# EAGLE design untitled (EAGLE 5.08)
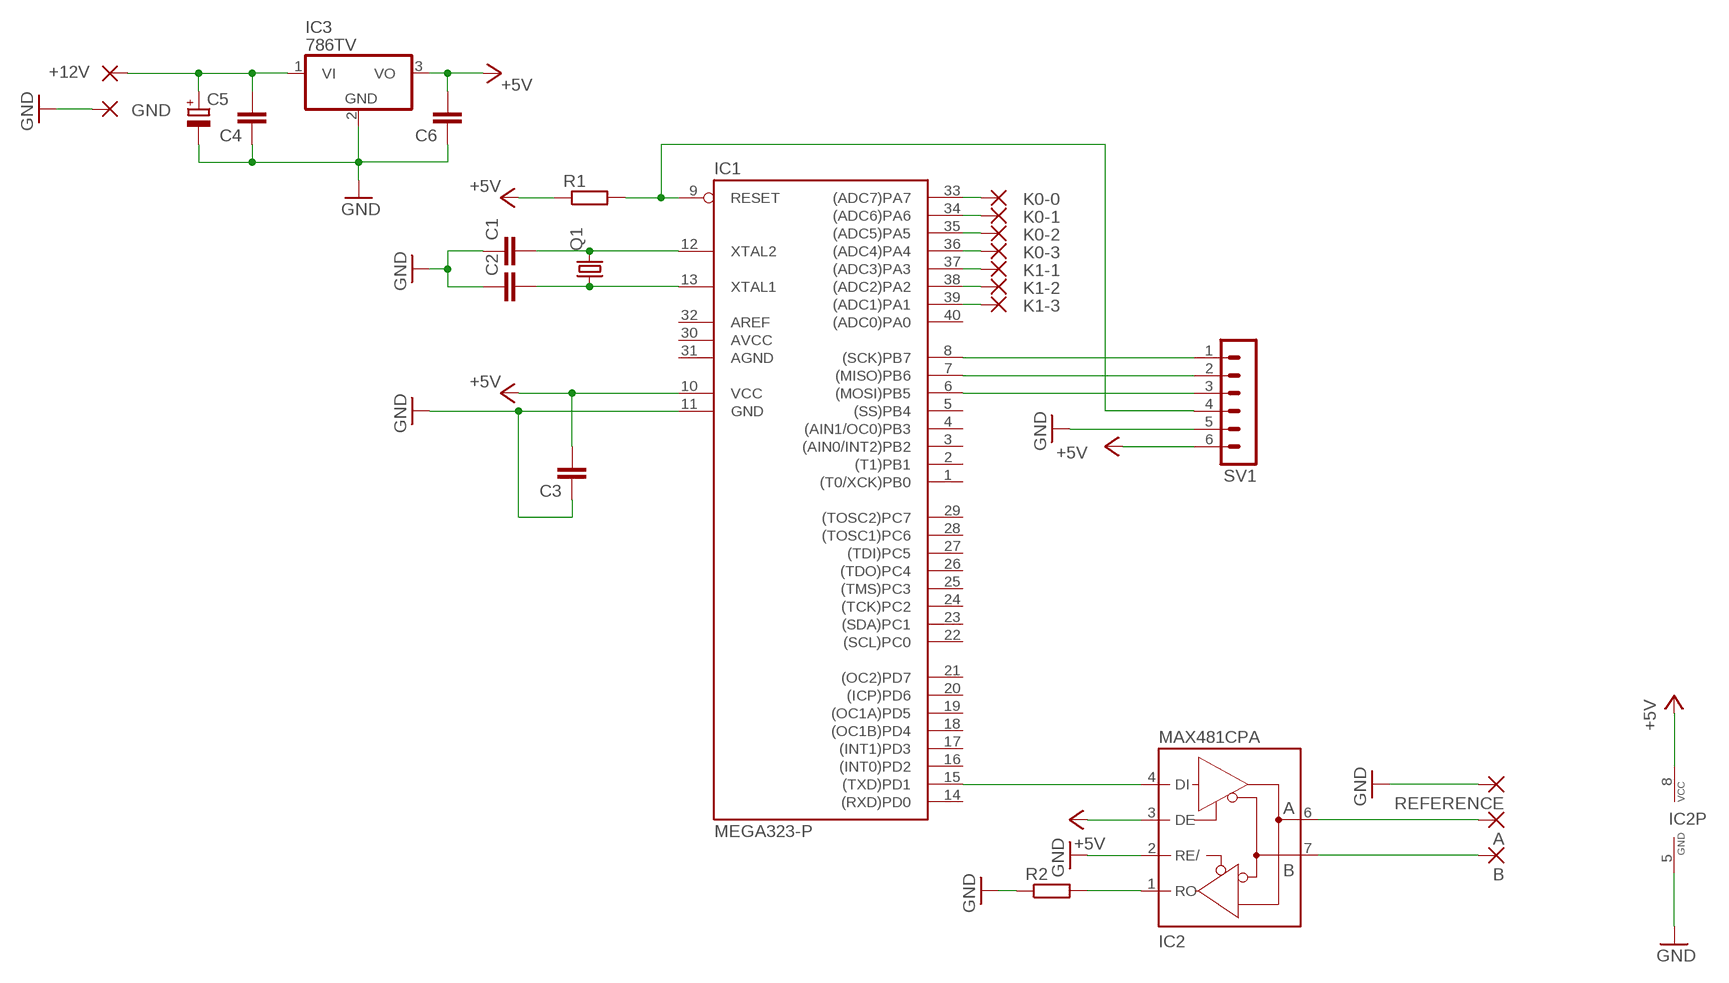
[diagram p0: schematic, sheet 1]

## Parts
+12V  2,54/0,8  [2,54/0,8]
A  2,54/0,8  [2,54/0,8]
B  2,54/0,8  [2,54/0,8]
C1  C-EU025-025X050  [C025-025X050]
C2  C-EU025-025X050  [C025-025X050]
C3  C-EU025-025X050  [C025-025X050]
C4  C-EU025-025X050  [C025-025X050]
C5  CPOL-EUE2.5-5  [E2,5-5]
C6  C-EU025-025X050  [C025-025X050]
GND  2,54/0,8  [2,54/0,8]
IC1  MEGA323-P  [DIL40]
IC2  MAX481CPA  [DIL08]
IC3  786TV  [TO220V]
K0-0  2,54/0,8  [2,54/0,8]
K0-1  2,54/0,8  [2,54/0,8]
K0-2  2,54/0,8  [2,54/0,8]
K0-3  2,54/0,8  [2,54/0,8]
K1-1  2,54/0,8  [2,54/0,8]
K1-2  2,54/0,8  [2,54/0,8]
K1-3  2,54/0,8  [2,54/0,8]
Q1  CRYSTALHC49S  [HC49/S]
R1  R-EU_0207/10  [0207/10]
R2  R-EU_0207/7  [0207/7]
REFERENCE  2,54/0,8  [2,54/0,8]
SV1  MA06-1  [MA06-1]

## Nets
+5V: C3.2 C6.2 IC1.10(VCC) IC2.3(DE) IC2.8(VCC) IC3.3(VO) R1.1 SV1.6
GND: C1.1 C2.1 C3.1 C4.1 C5.- C6.1 GND.1(P) IC1.11(GND) IC2.2(RE/) IC2.5(GND) IC3.2(GND) R2.1 REFERENCE.1(P) SV1.5
N$1: B.1(P) IC2.7(B)
N$2: A.1(P) IC2.6(A)
N$3: IC1.9(RESET) R1.2 SV1.4
N$4: IC1.15((TXD)PD1) IC2.4(DI)
N$5: C2.2 IC1.13(XTAL1) Q1.1
N$6: C1.2 IC1.12(XTAL2) Q1.2
N$7: IC1.33((ADC7)PA7) K0-0.1(P)
N$8: IC2.1(RO) R2.2
N$9: IC1.34((ADC6)PA6) K0-1.1(P)
N$10: IC1.35((ADC5)PA5) K0-2.1(P)
N$11: IC1.36((ADC4)PA4) K0-3.1(P)
N$12: IC1.37((ADC3)PA3) K1-1.1(P)
N$13: IC1.38((ADC2)PA2) K1-2.1(P)
N$14: IC1.39((ADC1)PA1) K1-3.1(P)
N$16: IC1.8((SCK)PB7) SV1.1
N$17: IC1.7((MISO)PB6) SV1.2
N$18: IC1.6((MOSI)PB5) SV1.3
N$20: +12V.1(P) C4.2 C5.+ IC3.1(VI)
Unconnected: IC1.1((T0/XCK)PB0) IC1.2((T1)PB1) IC1.3((AIN0/INT2)PB2) IC1.4((AIN1/OC0)PB3) IC1.5((SS)PB4) IC1.14((RXD)PD0) IC1.16((INT0)PD2) IC1.17((INT1)PD3) IC1.18((OC1B)PD4) IC1.19((OC1A)PD5) IC1.20((ICP)PD6) IC1.21((OC2)PD7) IC1.22((SCL)PC0) IC1.23((SDA)PC1) IC1.24((TCK)PC2) IC1.25((TMS)PC3) IC1.26((TDO)PC4) IC1.27((TDI)PC5) IC1.28((TOSC1)PC6) IC1.29((TOSC2)PC7) IC1.32(AREF) IC1.40((ADC0)PA0)

## Power pins joined to a net without a drawn wire
AGND: IC1.31(AGND)
AVCC: IC1.30(AVCC)

## Library data of the parts
+12V A B GND K0-0 K0-1-K0-3 K1-1-K1-3 REFERENCE = wirepad:2,54/0,8: THROUGH-HOLE PAD
C1-C4 C6 = rcl:C-EU: CAPACITOR, European symbol
C5 = rcl:CPOL-EU: POLARIZED CAPACITOR, European symbol
IC1 = atmel:MEGA323-P: MICROCONTROLLER 32 Kbytes FLASH 2 Kbytes SRAM 1 Kbytes EEPROM USART 8-channel 10 bit ADC Source: avr.lbr
IC2 = maxim:MAX481CPA: RS485 TRANSEIVER
IC3 = linear:78*: Positive VOLTAGE REGULATOR Source: http://cache.national.com/ds/LM/LM78L05.pdf http://www.fairchildsemi.com/ds/LM/LM7805.pdf
Q1 = crystal:CRYSTAL: CRYSTAL
R1 R2 = rcl:R-EU_: RESISTOR, European symbol
SV1 = con-lstb:MA06-1: PIN HEADER

## Board
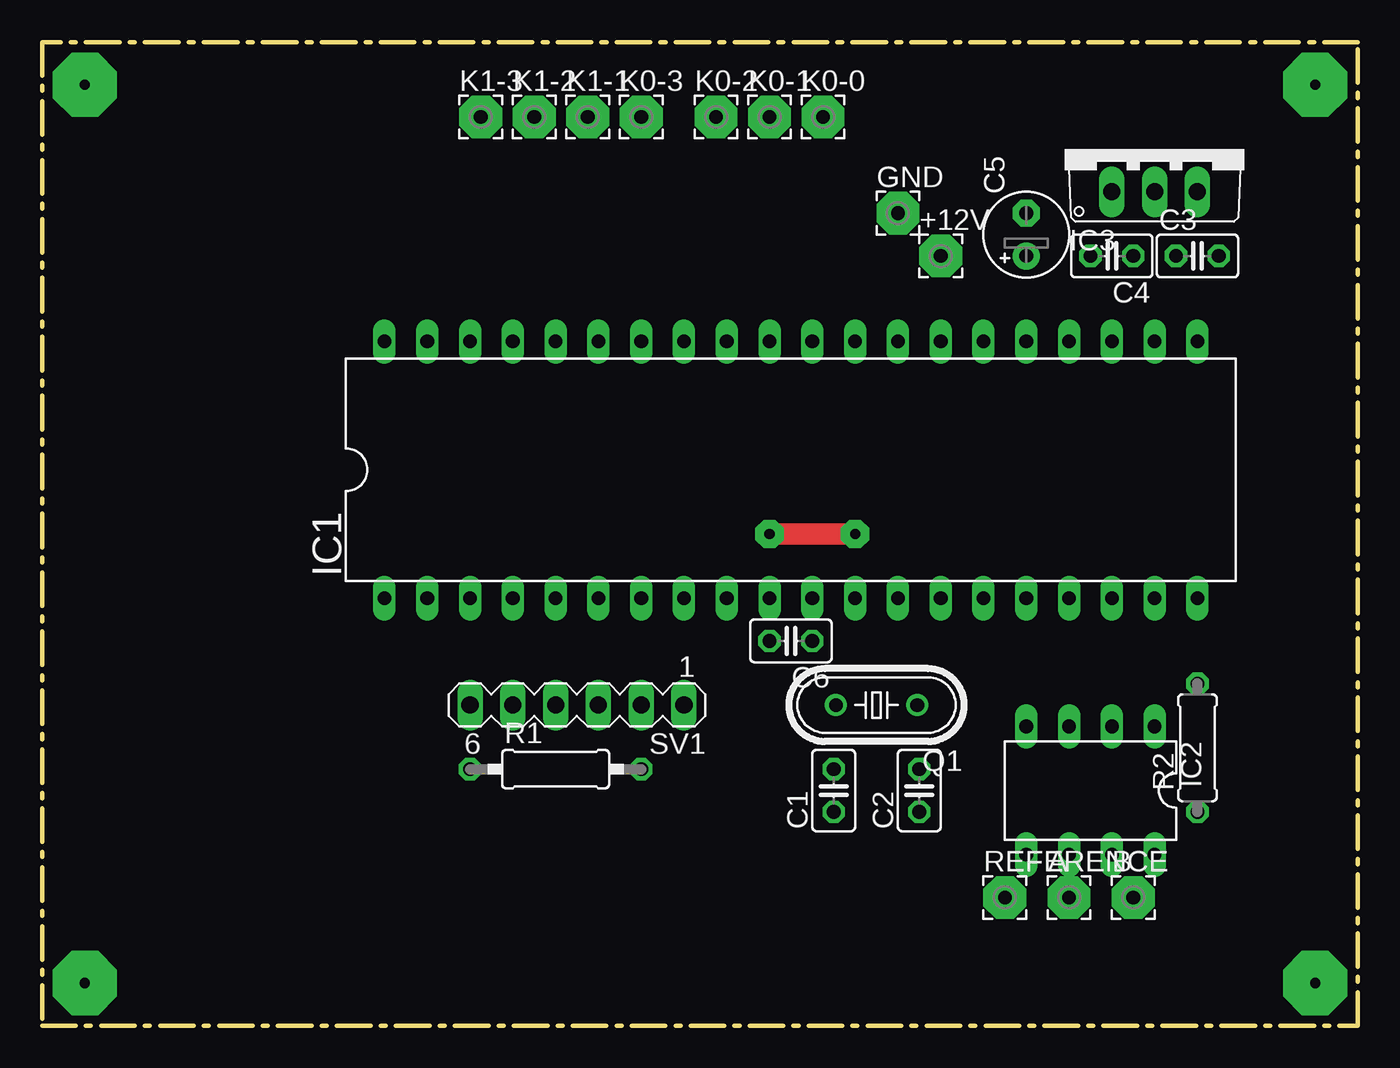
[diagram p1: board, top side]
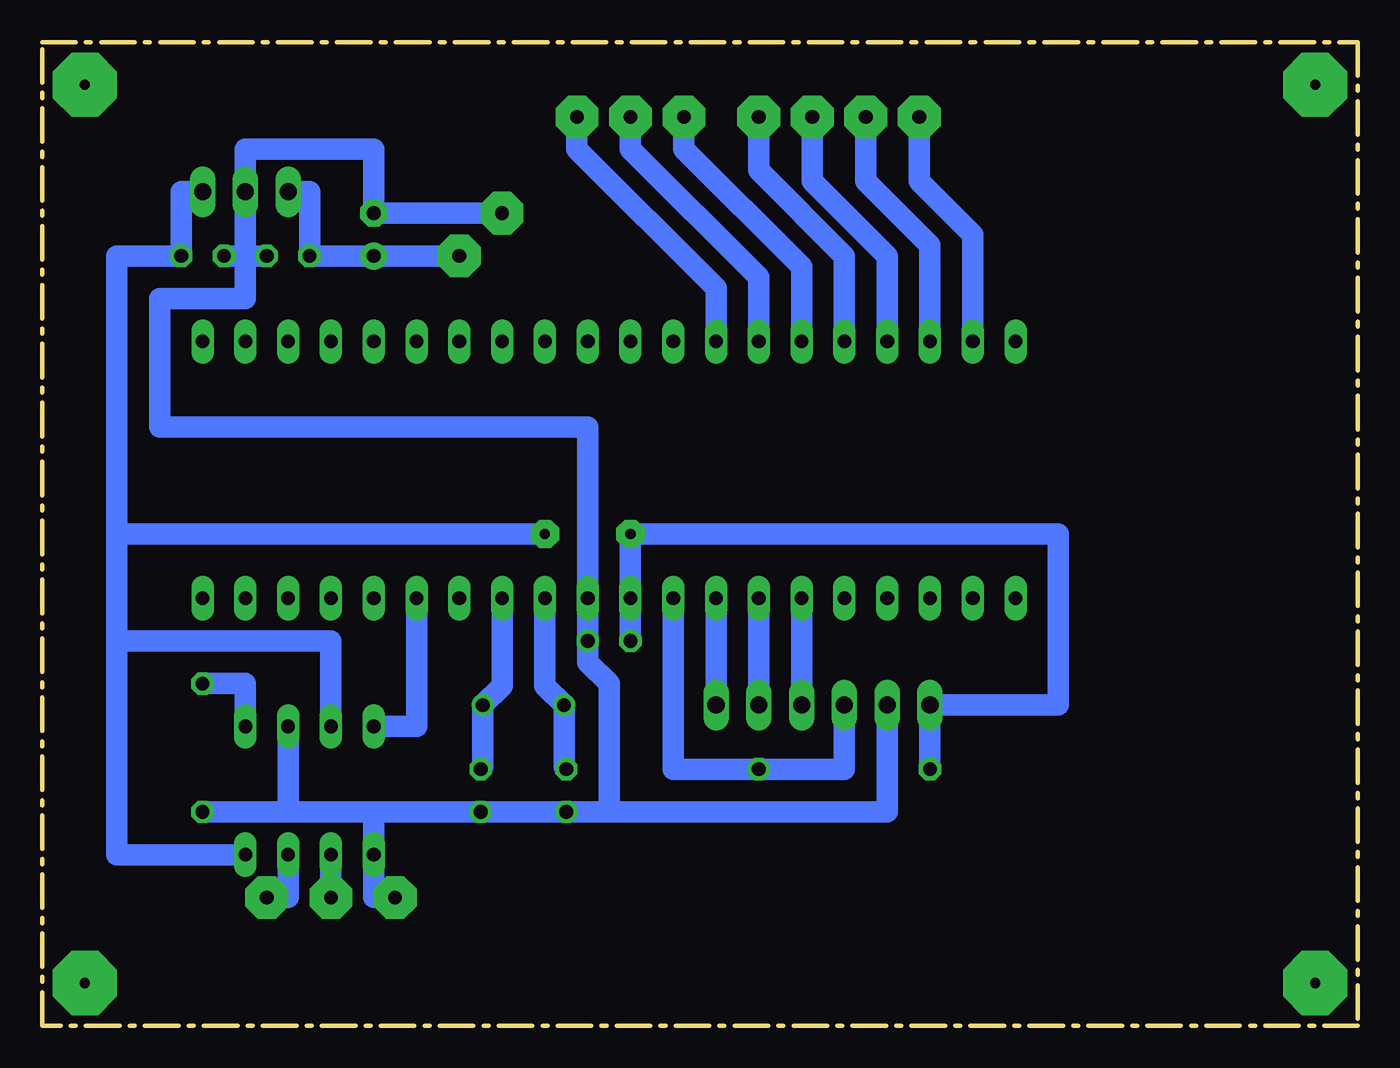
[diagram p2: board, bottom side, seen from below]

Size 78.1 x 58.42 mm. Coordinates in mm from the lower left corner, seen from the top.
Outline: 0,0 78.1,0 78.1,58.42 0,58.42 0,0
Copper layers (1*16): Top 0.035mm / dielectric 1.5mm / Bottom 0.035mm
Design rules "default": minimum track width 10mil, minimum drill 24mil, track to track 8mil, track to pad 8mil, pad to pad 8mil, via to via 8mil, smd to smd 8mil, copper to edge 40mil, drill to drill 8mil, minimum pad ring 10mil, minimum via ring 8mil, stop-mask expansion 4mil, vias tented up to drill 0mil, thermal gap 10mil

### Footprints (pad centres in the part's own frame; a part is rotated, then mirrored left to right if it is on the bottom)
2,54/0,8 = drill 0.813 pad 2.54 octagon: 1 0,0
C025-025X050 = drill 0.813 octagon: 1 -1.27,0; 2 1.27,0
E2,5-5 = drill 0.813 pad 1.6 round: + -1.27,0 | drill 0.813 pad 1.6 octagon: - 1.27,0
DIL40 = drill 0.813 long: 1 -24.13,-7.62; 2 -21.59,-7.62; 3 -19.05,-7.62; 4 -16.51,-7.62; 5 -13.97,-7.62; 6 -11.43,-7.62; 7 -8.89,-7.62; 8 -6.35,-7.62; 9 -3.81,-7.62; 10 -1.27,-7.62; 11 1.27,-7.62; 12 3.81,-7.62; 13 6.35,-7.62; 14 8.89,-7.62; 15 11.43,-7.62; 16 13.97,-7.62; 17 16.51,-7.62; 18 19.05,-7.62; 19 21.59,-7.62; 20 24.13,-7.62; 21 24.13,7.62; 22 21.59,7.62; 23 19.05,7.62; 24 16.51,7.62; 25 13.97,7.62; 26 11.43,7.62; 27 8.89,7.62; 28 6.35,7.62; 29 3.81,7.62; 30 1.27,7.62; 31 -1.27,7.62; 32 -3.81,7.62; 33 -6.35,7.62; 34 -8.89,7.62; 35 -11.43,7.62; 36 -13.97,7.62; 37 -16.51,7.62; 38 -19.05,7.62; 39 -21.59,7.62; 40 -24.13,7.62
DIL08 = drill 0.813 long: 1 -3.81,-3.81; 2 -1.27,-3.81; 3 1.27,-3.81; 4 3.81,-3.81; 5 3.81,3.81; 6 1.27,3.81; 7 -1.27,3.81; 8 -3.81,3.81
TO220V = drill 1.016 long: 1 -2.54,-2.54; 2 0,-2.54; 3 2.54,-2.54
HC49/S = drill 0.813 round: 1 -2.413,0; 2 2.413,0
0207/10 = drill 0.813 octagon: 1 -5.08,0; 2 5.08,0
0207/7 = drill 0.813 octagon: 1 -3.81,0; 2 3.81,0
MA06-1 = drill 1.016 long: 1 -6.35,0; 2 -3.81,0; 3 -1.27,0; 4 1.27,0; 5 3.81,0; 6 6.35,0

### Placement (x,y rotation side)
+12V  53.34,45.72 0 top
A  60.96,7.62 0 top
B  64.77,7.62 0 top
C1  46.99,13.97 90 top
C2  52.07,13.97 90 top
C3  68.58,45.72 0 top
C4  63.5,45.72 180 top
C5  58.42,46.99 90 top
C6  44.45,22.86 180 top
GND  50.8,48.26 0 top
IC1  44.45,33.02 0 top
IC2  62.23,13.97 180 top
IC3  66.04,52.07 0 top
K0-0  46.35,53.97 0 top
K0-1  43.18,53.97 0 top
K0-2  40,53.97 0 top
K0-3  35.56,53.97 0 top
K1-1  32.38,53.97 0 top
K1-2  29.21,53.97 0 top
K1-3  26.03,53.97 0 top
Q1  49.53,19.05 180 top
R1  30.48,15.24 0 top
R2  68.58,16.51 90 top
REFERENCE  57.15,7.62 0 top
SV1  31.75,19.05 180 top

### Tracks (layer width: path | path; a pad name or v marks a point on that pad's centre or on a via)
+5V  (via drill 0.6 pad 1.68)
  Top 1.27: v48.26,29.21 v43.18,29.21
  Bottom 1.27: R1.1 SV1.6 17.78,19.05 17.78,29.21 v43.18,29.21 IC1.10 C6.2 | IC2.3 60.96,22.86 73.66,22.86 | IC2.8 73.66,10.16 73.66,22.86 | IC3.3 69.85,49.53 C3.2 73.66,45.72 73.66,29.21 | 73.66,29.21 73.66,22.86 | 73.66,29.21 v48.26,29.21
GND
  Bottom 1.27: 44.45,12.7 44.45,20.32 45.72,21.59 C6.1 IC1.11 45.72,35.56 71.12,35.56 71.12,43.18 66.04,43.18 66.04,45.72 | 44.45,12.7 C1.1 C2.1 58.42,12.7 | SV1.5 27.94,12.7 44.45,12.7 | 63.5,12.7 IC2.2 | 58.42,12.7 63.5,12.7 | 58.42,12.7 IC2.5 58.42,7.62 REFERENCE.1 | 63.5,12.7 R2.1 | GND.1 C5.- 58.42,52.07 66.04,52.07 IC3.2 66.04,45.72 | 66.04,45.72 C4.1 | 66.04,45.72 C3.1
N$1
  Bottom 1.27: IC2.7 63.5,7.62 B.1
N$2
  Bottom 1.27: IC2.6 A.1
N$3
  Bottom 1.27: SV1.4 30.48,15.24 R1.2 40.64,15.24 IC1.9
N$4
  Bottom 1.27: IC2.4 55.88,17.78 IC1.15
N$5
  Bottom 1.27: IC1.13 50.8,20.19 Q1.1 51.94,15.37 C2.2
N$6
  Bottom 1.27: IC1.12 48.26,20.19 Q1.2 47.12,15.37 C1.2
N$7
  Bottom 1.27: K0-0.1 46.35,52.07 38.1,43.81 IC1.33
N$8
  Bottom 1.27: R2.2 66.04,20.32 IC2.1
N$9
  Bottom 1.27: K0-1.1 43.18,52.07 35.56,44.45 IC1.34
N$10
  Bottom 1.27: K0-2.1 40,52.07 33.02,45.09 IC1.35
N$11
  Bottom 1.27: K0-3.1 35.56,50.8 30.48,45.72 IC1.36
N$12
  Bottom 1.27: K1-1.1 32.38,50.16 27.94,45.72 IC1.37
N$13
  Bottom 1.27: K1-2.1 29.21,50.16 25.4,46.36 IC1.38
N$14
  Bottom 1.27: K1-3.1 26.03,50.16 22.86,46.99 IC1.39
N$15  (via drill 0.6 pad 3.81)
  other vias: 75.56,55.88
N$16
  Bottom 1.27: IC1.8 SV1.1
N$17
  Bottom 1.27: IC1.7 SV1.2
N$18
  Bottom 1.27: IC1.6 SV1.3
N$19  (via drill 0.6 pad 3.81)
  other vias: 2.54,55.88
N$20
  Bottom 1.27: +12V.1 C5.+ C4.2 62.23,49.53 IC3.1
N$21  (via drill 0.6 pad 3.81)
  other vias: 2.54,2.54
N$22  (via drill 0.6 pad 3.81)
  other vias: 75.56,2.54